# EasyEDA schematic SCH_Breakout Boards_2023-05-21.json
TITLE: EPM7128S BreakOut Board; REV: 1.0; Date: 2023-05-21; Sheet: 1/1; Drawn By: Dom Emond; Company: Your Company
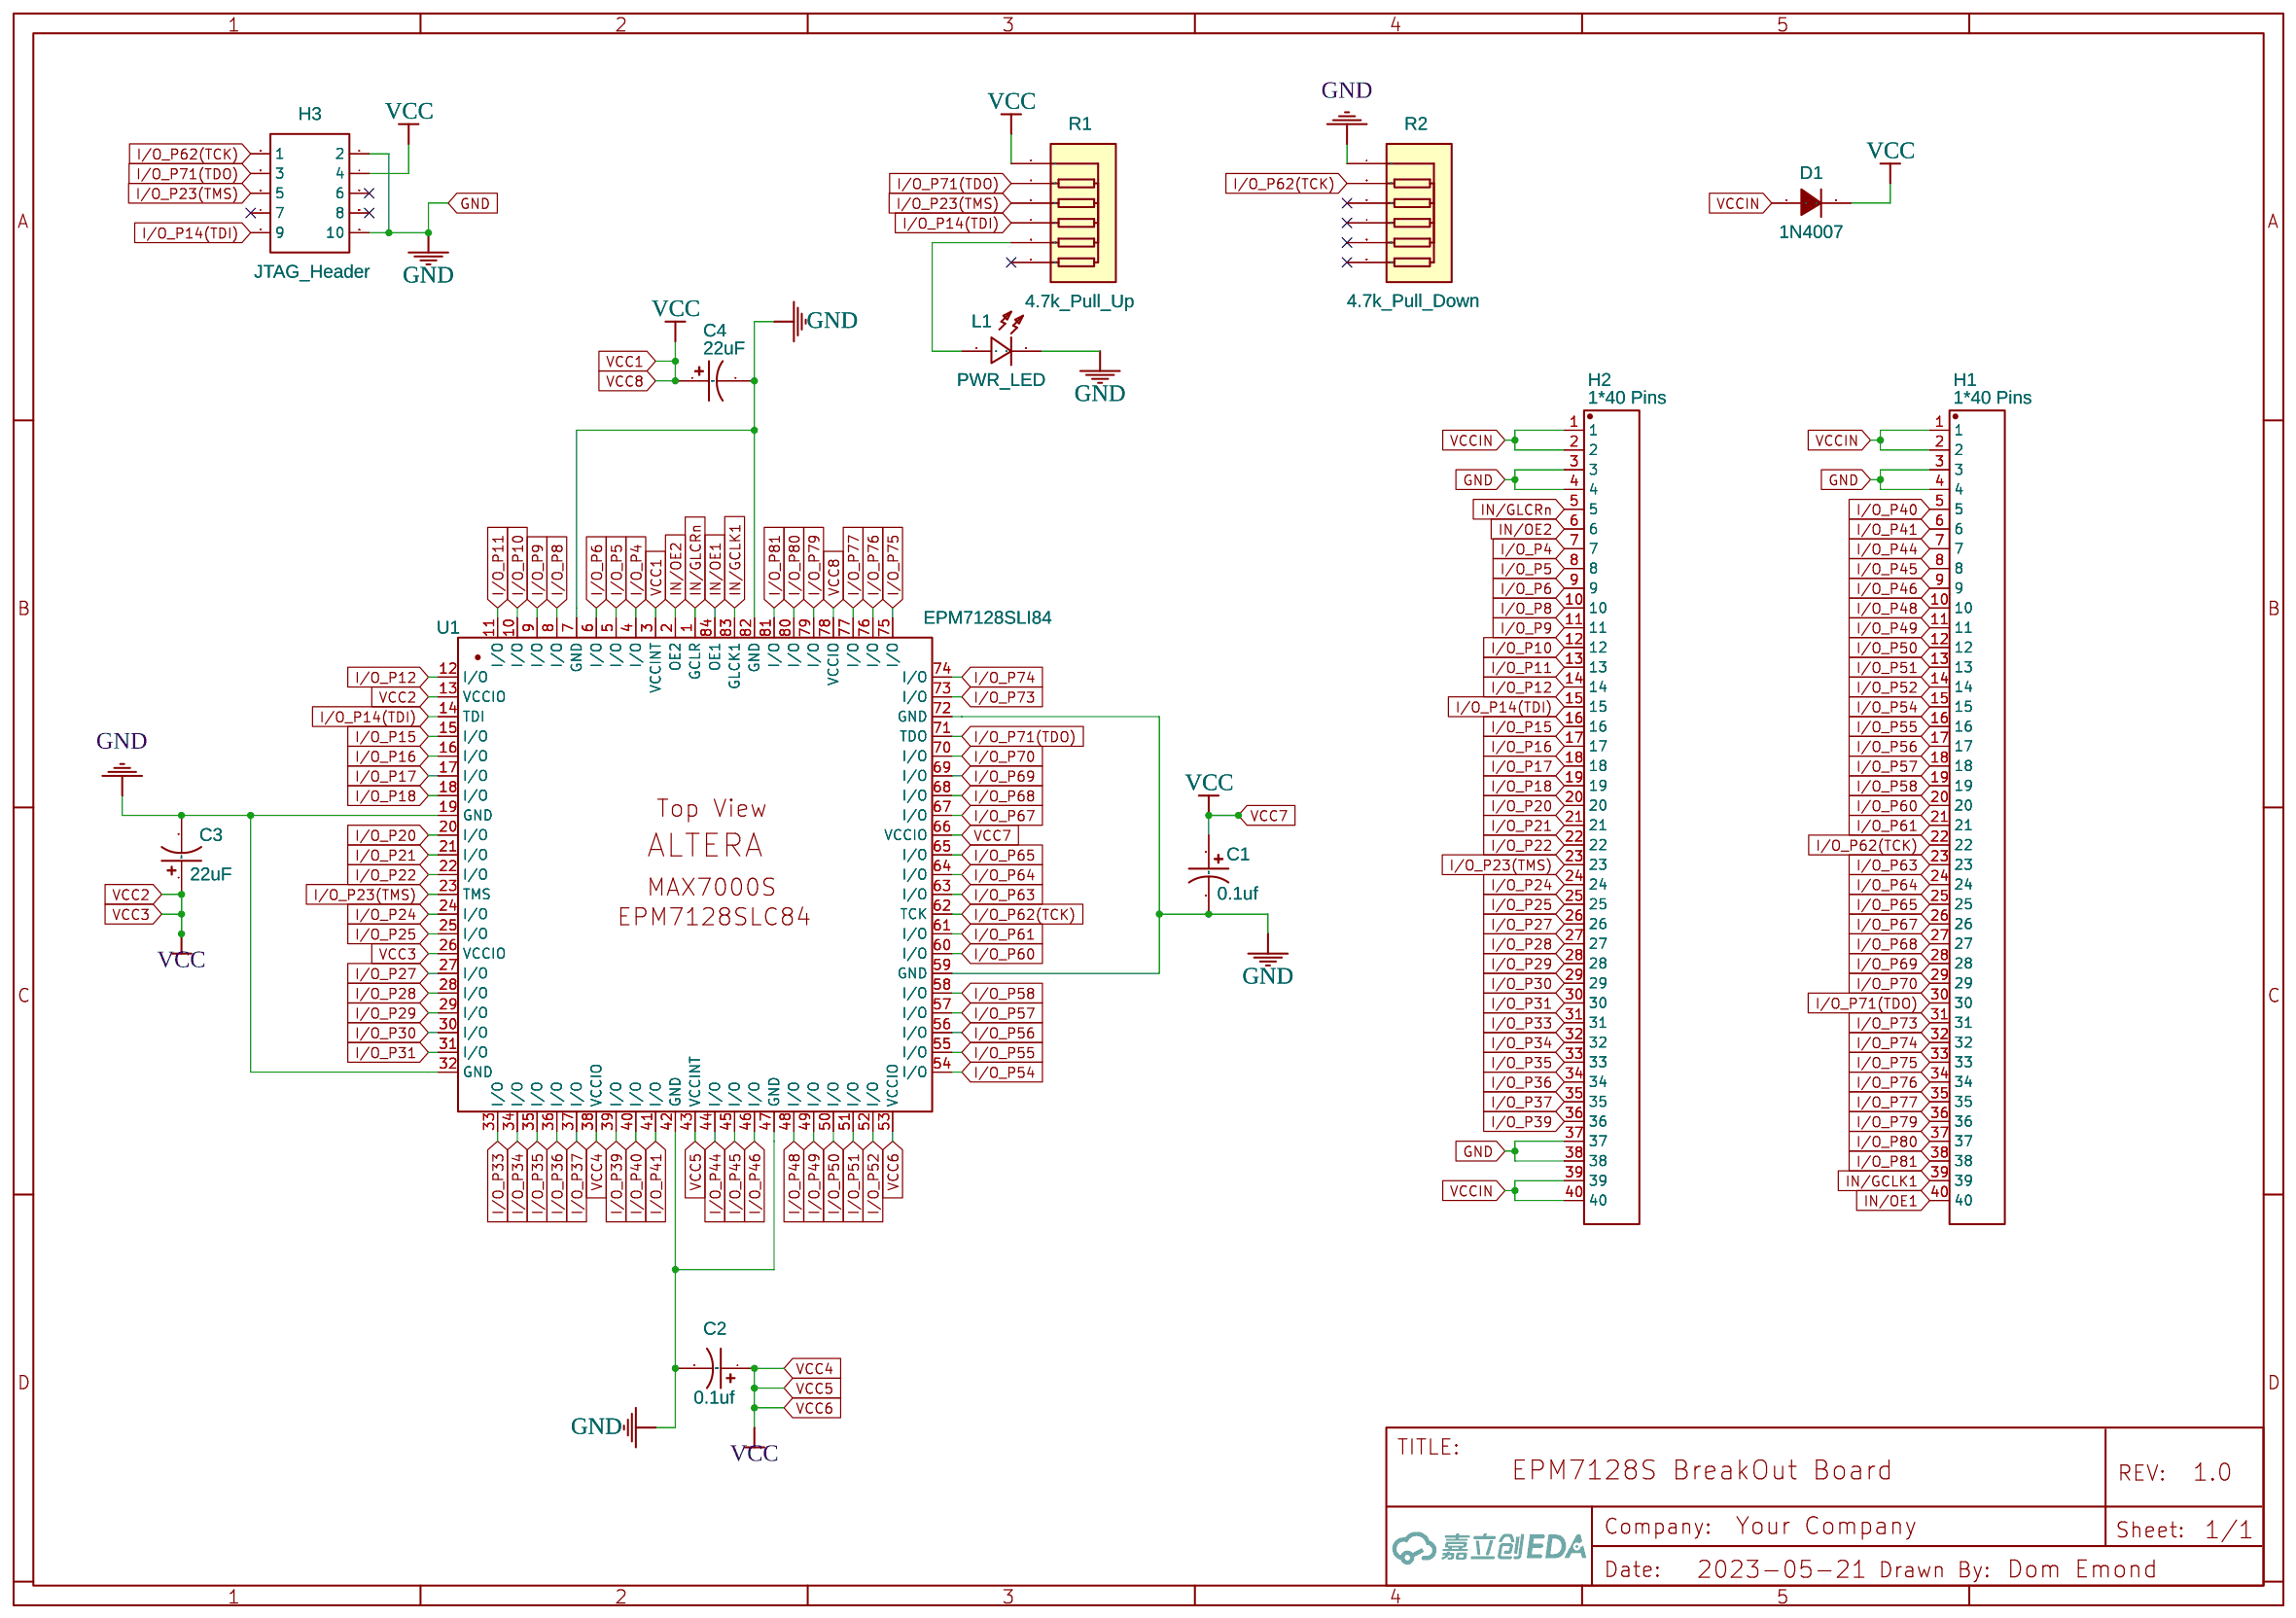
[diagram p0: schematic sheet]

## Parts
C1  0.1uf  [CAP-TH_BD6.3-P2.50-D1.0-FD]
C2  0.1uf  [CAP-TH_BD6.3-P2.50-D1.0-FD]
C3  22uF  [CAP-TH_BD6.3-P2.50-D1.0-FD]
C4  22uF  [CAP-TH_BD6.3-P2.50-D1.0-FD]
D1  1N4007  [1N-4007]
H1  1*40 Pins  [HDR-TH_40P-P2.54-V-M-1]
H2  1*40 Pins  [HDR-TH_40P-P2.54-V-M-1]
H3  JTAG_Header  [HDR-TH_10P-P2.54-V-M-R2-C5-S2.54]
L1  PWR_LED  [LED-TH_BD3.0-P2.54-FD]
R1  4.7k_Pull_Up  [RES-ARRAY-TH_6P-P2.54-D1.0]
R2  4.7k_Pull_Down  [RES-ARRAY-TH_6P-P2.54-D1.0]
U1  EPM7128SLI84  [PLCC84_PTH-SKT]

## Library data of the parts
C1-C4 = 35MH522MEFC6.3X5: Supplier: LCSC; Supplier Part: C473191; Manufacturer: Rubycon; Contributor: LCSC
D1 = 1N4007: Supplier Part: C108803; Supplier: LCSC; Manufacturer: Jingdao; Manufacturer Part: 1N4007W; Contributor: anoop
H1 H2 = 2.54mm 1*40P Reverse bending Headers  Pins_C29775: Supplier Part: C29775; Supplier: LCSC; Manufacturer: ReliaPro; Manufacturer Part: 2.54mm 1*40P Reverse bending Headers  Pins
H3 = Header-Male-2.54_2x5: Supplier: LCSC; Manufacturer Part: 2*5pHeaders  Pins 2.54mm; Supplier Part: C28207; JLCPCB Part Class: Extended Part
L1 = LED-2: Supplier: LCSC; Supplier Part: C9900015223; Manufacturer: null; Contributor: lcsc; JLCPCB Part Class: Extended Part
R1 R2 = A06-102JP_C969103: Supplier: LCSC; Supplier Part: C969103; Manufacturer: null; Manufacturer Part: A06-102JP; Contributor: LCSC
U1 = EPM7128SLI84-10: Supplier Part: C2829062; Manufacturer: null; Paste Type: Extended Part; Contributor: gdampf; JLCPCB Part Class: Extended Part

## Nets
GND: C1.2 C2.2 C3.2 C4.2 H1.3 H1.4 H2.3 H2.4 H2.37 H2.38 H3.2 H3.10 L1.1(E) R2.1 U1.7(GND) U1.19(GND) U1.32(GND) U1.42(GND) U1.47(GND) U1.59(GND) U1.72(GND) U1.82(GND)
VCC: C1.1 C2.1 C3.1 C4.1 D1.2(K) H3.4 R1.1 U1.3(VCCINT) U1.13(VCCIO) U1.26(VCCIO) U1.38(VCCIO) U1.43(VCCINT) U1.53(VCCIO) U1.66(VCCIO) U1.78(VCCIO)
VCCIN: D1.1(A) H1.1 H1.2 H2.1 H2.2 H2.39 H2.40
I/O_P4: H2.7 U1.4(I/O)
I/O_P5: H2.8 U1.5(I/O)
I/O_P6: H2.9 U1.6(I/O)
I/O_P8: H2.10 U1.8(I/O)
I/O_P9: H2.11 U1.9(I/O)
I/O_P10: H2.12 U1.10(I/O)
I/O_P11: H2.13 U1.11(I/O)
I/O_P12: H2.14 U1.12(I/O)
I/O_P14(TDI): H2.15 H3.9 R1.4 U1.14(TDI)
I/O_P15: H2.16 U1.15(I/O)
I/O_P16: H2.17 U1.16(I/O)
I/O_P17: H2.18 U1.17(I/O)
I/O_P18: H2.19 U1.18(I/O)
I/O_P20: H2.20 U1.20(I/O)
I/O_P21: H2.21 U1.21(I/O)
I/O_P22: H2.22 U1.22(I/O)
I/O_P23(TMS): H2.23 H3.5 R1.3 U1.23(TMS)
I/O_P24: H2.24 U1.24(I/O)
I/O_P25: H2.25 U1.25(I/O)
I/O_P27: H2.26 U1.27(I/O)
I/O_P28: H2.27 U1.28(I/O)
I/O_P29: H2.28 U1.29(I/O)
I/O_P30: H2.29 U1.30(I/O)
I/O_P31: H2.30 U1.31(I/O)
I/O_P33: H2.31 U1.33(I/O)
I/O_P34: H2.32 U1.34(I/O)
I/O_P35: H2.33 U1.35(I/O)
I/O_P36: H2.34 U1.36(I/O)
I/O_P37: H2.35 U1.37(I/O)
I/O_P39: H2.36 U1.39(I/O)
I/O_P40: H1.5 U1.40(I/O)
I/O_P41: H1.6 U1.41(I/O)
I/O_P44: H1.7 U1.44(I/O)
I/O_P45: H1.8 U1.45(I/O)
I/O_P46: H1.9 U1.46(I/O)
I/O_P48: H1.10 U1.48(I/O)
I/O_P49: H1.11 U1.49(I/O)
I/O_P50: H1.12 U1.50(I/O)
I/O_P51: H1.13 U1.51(I/O)
I/O_P52: H1.14 U1.52(I/O)
I/O_P54: H1.15 U1.54(I/O)
I/O_P55: H1.16 U1.55(I/O)
I/O_P56: H1.17 U1.56(I/O)
I/O_P57: H1.18 U1.57(I/O)
I/O_P58: H1.19 U1.58(I/O)
I/O_P60: H1.20 U1.60(I/O)
I/O_P61: H1.21 U1.61(I/O)
I/O_P62(TCK): H1.22 H3.1 R2.2 U1.62(TCK)
I/O_P63: H1.23 U1.63(I/O)
I/O_P64: H1.24 U1.64(I/O)
I/O_P65: H1.25 U1.65(I/O)
I/O_P67: H1.26 U1.67(I/O)
I/O_P68: H1.27 U1.68(I/O)
I/O_P69: H1.28 U1.69(I/O)
I/O_P70: H1.29 U1.70(I/O)
I/O_P71(TDO): H1.30 H3.3 R1.2 U1.71(TDO)
I/O_P73: H1.31 U1.73(I/O)
I/O_P74: H1.32 U1.74(I/O)
I/O_P75: H1.33 U1.75(I/O)
I/O_P76: H1.34 U1.76(I/O)
I/O_P77: H1.35 U1.77(I/O)
I/O_P79: H1.36 U1.79(I/O)
I/O_P80: H1.37 U1.80(I/O)
I/O_P81: H1.38 U1.81(I/O)
IN/GCLK1: H1.39 U1.83(GLCK1)
IN/GLCRn: H2.5 U1.1(GCLR)
IN/OE1: H1.40 U1.84(OE1)
IN/OE2: H2.6 U1.2(OE2)
Net-(L1-2): L1.2(C) R1.5

Not connected (* = marked no-connect by the designer): H3 6* 7* 8*; R1 6*; R2 3* 4* 5* 6*
